# Altium schematic sheet signal3.SchDoc
size A4; SheetNumber: 3; SheetTotal: 6
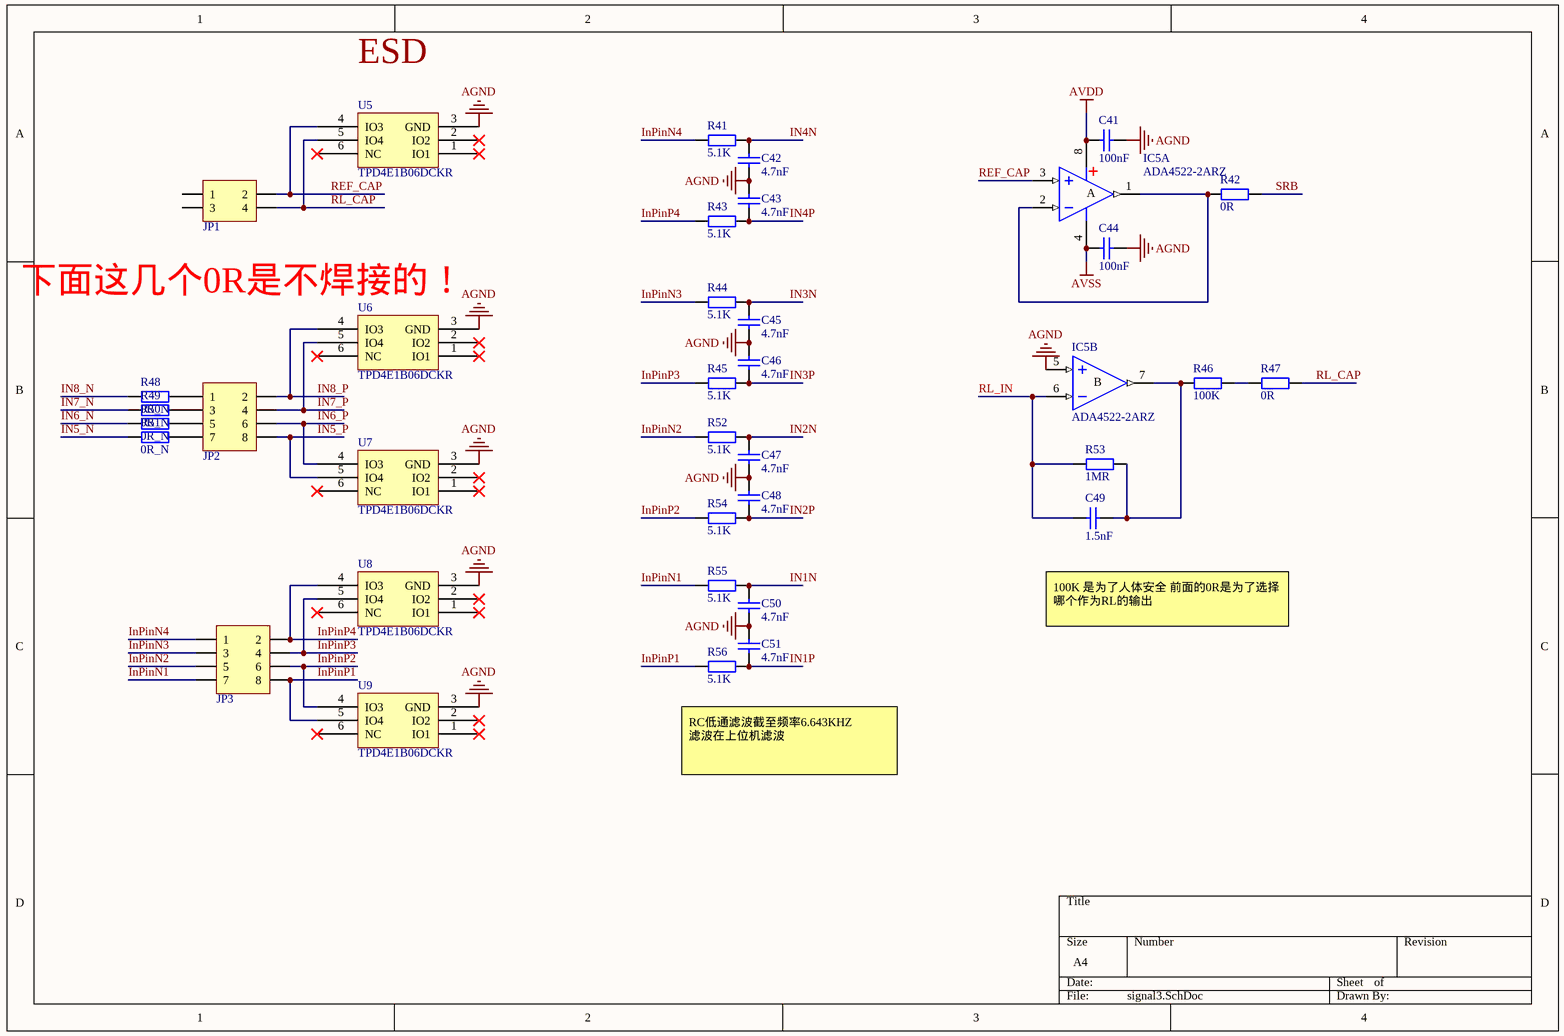
[diagram p0: signal3.SchDoc]

## Parts
C41  100nF  [C0603_L]
C42  4.7nF  [C0603_L]
C43  4.7nF  [C0603_L]
C44  100nF  [C0603_L]
C45  4.7nF  [C0603_L]
C46  4.7nF  [C0603_L]
C47  4.7nF  [C0603_L]
C48  4.7nF  [C0603_L]
C49  1.5nF  [C0603_L]
C50  4.7nF  [C0603_L]
C51  4.7nF  [C0603_L]
IC5  ADA4522-2ARZ  [SOIC-8]  (parts A,B of 2)
JP1  Header2X2  [HDR2.54-WI-2x2P]  (value not drawn)
JP2  Header 4X2  [HDR2.54-WI-2x4P]  (value not drawn)
JP3  Header 4X2  [HDR2.54-WI-2x4P]  (value not drawn)
R41  5.1K  [R0603_L]
R42  0R  [R0603_L]
R43  5.1K  [R0603_L]
R44  5.1K  [R0603_L]
R45  5.1K  [R0603_L]
R46  100K  [R0603_L]
R47  0R  [R0603_L]
R48  0R_N  [R0603_L]
R49  0R_N  [R0603_L]
R50  0R_N  [R0603_L]
R51  0R_N  [R0603_L]
R52  5.1K  [R0603_L]
R53  1MR  [R0603_L]
R54  5.1K  [R0603_L]
R55  5.1K  [R0603_L]
R56  5.1K  [R0603_L]
U5  TPD4E1B06DCKR  [SOT363_N]
U6  TPD4E1B06DCKR  [SOT363_N]
U7  TPD4E1B06DCKR  [SOT363_N]
U8  TPD4E1B06DCKR  [SOT363_N]
U9  TPD4E1B06DCKR  [SOT363_N]

## Nets
AGND: C41.2 C42.1 C43.2 C44.2 C45.1 C46.2 C47.1 C48.2 C50.1 C51.2 IC5.5(IN+) U5.3(GND) U6.3(GND) U7.3(GND) U8.3(GND) U9.3(GND)
AVDD: C41.1 IC5.8(V+)
AVSS: C44.1 IC5.4(V-)
IN1N: C50.2 R55.2
IN1P: C51.1 R56.2
IN2N: C47.2 R52.2
IN2P: C48.1 R54.2
IN3N: C45.2 R44.2
IN3P: C46.1 R45.2
IN4N: C42.2 R41.2
IN4P: C43.1 R43.2
IN5_N: R51.2
IN5_P: JP2.8 U7.5(IO4)
IN6_N: R50.2
IN6_P: JP2.6 U7.4(IO3)
IN7_N: R49.2
IN7_P: JP2.4 U6.5(IO4)
IN8_N: R48.2
IN8_P: JP2.2 U6.4(IO3)
InPinN1: JP3.7 R55.1
InPinN2: JP3.5 R52.1
InPinN3: JP3.3 R44.1
InPinN4: JP3.1 R41.1
InPinP1: JP3.8 R56.1 U9.5(IO4)
InPinP2: JP3.6 R54.1 U9.4(IO3)
InPinP3: JP3.4 R45.1 U8.5(IO4)
InPinP4: JP3.2 R43.1 U8.4(IO3)
REF_CAP: IC5.3(IN+) JP1.2 U5.4(IO3)
RL_CAP: JP1.4 R47.1 U5.5(IO4)
RL_IN: C49.1 IC5.6(IN-) R53.2
SRB: R42.1
NetC49_2: C49.2 IC5.7(OUT) R46.2 R53.1
NetIC5_1: IC5.1(OUT) IC5.2(IN-) R42.2
NetJP2_1: JP2.1 R48.1
NetJP2_3: JP2.3 R49.1
NetJP2_5: JP2.5 R50.1
NetJP2_7: JP2.7 R51.1
NetR46_1: R46.1 R47.2

Not connected (* = marked no-connect by the designer): JP1 1 3; U5 1(IO1)* 2(IO2)* 6(NC)*; U6 1(IO1)* 2(IO2)* 6(NC)*; U7 1(IO1)* 2(IO2)* 6(NC)*; U8 1(IO1)* 2(IO2)* 6(NC)*; U9 1(IO1)* 2(IO2)* 6(NC)*

## Notes on the sheet
- ESD
- 下面这几个0R是不焊接的！
- 100K 是为了人体安全 前面的0R是为了选择哪个作为RL的输出
- RC低通滤波截至频率6.643KHZ
  滤波在上位机滤波
- (in symbol ADA4522-2ARZ, part A) A
- (in symbol ADA4522-2ARZ, part B) B

## Library data of the parts
C41-C51 = C: 贴片电容/MLCC电容; BOM名称: 无极性贴片电容; 联系下单店铺卖家 免费帮你查找封装: 联系下单店铺卖家 免费技术指导
IC5 = ADA4522-2ARZ: 双通道55V、EMI增强型、零漂移、超低噪声、RRO运算放大器; BOM名称: 双路运放; 封装库来自淘宝卖家：黄晶宝石: 其他店铺购入均为赃物，无售后更新权益，请立即申请退款，退款后现金奖励200~1000元; jlc_id: C403697
JP1 = Header 2X2: 2*2P接插件; 联系卖家，免费查找封装: 唯一出售店铺网址https://shop463601444.taobao.com; 封装库来自淘宝卖家ID：黄晶宝石: 其他店铺购入均为盗版封装库，请立即申请退款，本店现金奖励50~200元; BOM名称: 2*2P接插件
JP2 JP3 = Header 4X2: 4*2P接插件; 联系卖家，免费查找封装: 唯一出售店铺网址https://shop463601444.taobao.com; 封装库来自淘宝卖家ID：黄晶宝石: 其他店铺购入均为盗版封装库，请立即申请退款，本店现金奖励50~200元; BOM名称: 4*2P接插件
R41-R56 = R: 贴片电阻; 联系下单店铺卖家 免费帮你查找封装: 联系下单店铺卖家 免费技术指导; BOM名称: 贴片电阻
U5-U9 = TPD4E1B06DCKR: 具有 0.5nA 最大泄漏电流的四路 0.7pF、±5.5V、±12kV ESD 保护二极管; jlc_id: C840093